# Altium schematic sheet Relay.SchDoc
size A4
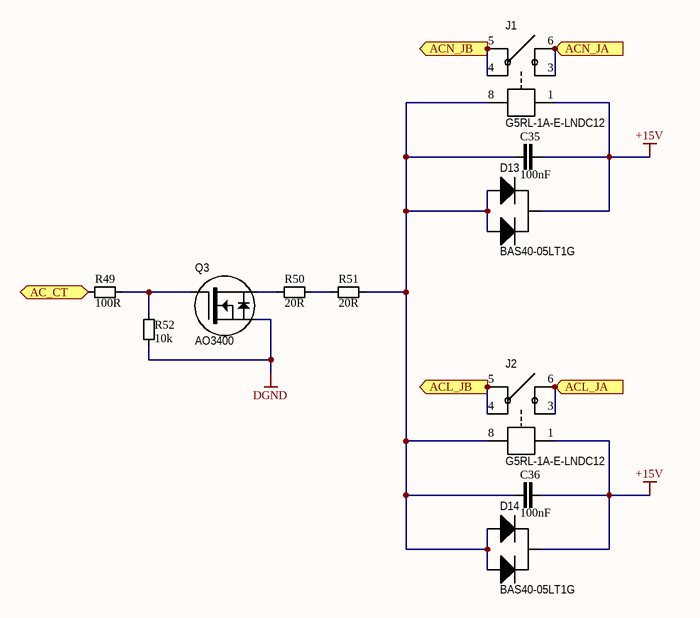
[diagram p0: Relay.SchDoc]

## Parts
C35  value 100nF  [0603-C]  (hidden comment: Cap)
C36  value 100nF  [0603-C]  (hidden comment: Cap)
D13  BAS40-05LT1G  [SOT-23_N]
D14  BAS40-05LT1G  [SOT-23_N]
J1  G5RL-1A-E-LNDC12  [G5RL-1A-E]
J2  G5RL-1A-E-LNDC12  [G5RL-1A-E]
Q3  AO3400  [SOT-23_N]
R49  value 100R  [0603-R]  (hidden comment: Res)
R50  value 20R  [1206-R]  (hidden comment: Res)
R51  value 20R  [1206-R]  (hidden comment: Res)
R52  value 10k  [0603-R]  (hidden comment: Res)

## Ports
AC_CT (in), ACL_JA (in), ACL_JB (out), ACN_JA (in), ACN_JB (out)

## Nets
+15V: C35.2 C36.2 D13.3 D14.3 J1.1 J2.1
DGND: Q3.2(S) R52.2
AC_CT: R49.1 ; port AC_CT
ACL_JA: J2.3 J2.6 ; port ACL_JA
ACL_JB: J2.4 J2.5 ; port ACL_JB
ACN_JA: J1.3 J1.6 ; port ACN_JA
ACN_JB: J1.4 J1.5 ; port ACN_JB
NetC35_1: C35.1 C36.1 D13.1 D13.2 D14.1 D14.2 J1.8 J2.8 R51.2
NetQ3_1: Q3.1(G) R49.2 R52.1
NetQ3_3: Q3.3(D) R50.1
NetR50_2: R50.2 R51.1

## Library data of the parts
C35 C36 = C21C100NK1H0: MLCC 100nF 10% 50V X7R 0603; TemperatureRange: -55°C to 150°C; VenderID: MLCC-0603-50V-104K-X7R; Published: 1-Jun-2017; Publisher: GreenBox; MountType: SMT; PackageReference: 0603; Manufacturer: *
D13 D14 = D842BAS4005O: Dual Series Schottky Barrier Diode BAS40-05LT1G Vrrm 40V If 0.12A Ir 1uA; Manufacturer: ON SEMICONDUCTOR; TemperatureRange: -55 to 150°C; MountType: SMT; PackageReference: SOT-23; Published: 1-Jun-2017; Publisher: GreenBox; VenderID: BAS40-05LT1G
J1 J2 = JNDZG5RL1122: Power/Signal Relay G5RL-1A-E-LNDC12 16A 250VAC 12VDC; Manufacturer: OMRON; TemperatureRange: -40 to 70°C; MountType: DIP; PackageReference: G5RL-1A-E; Published: 1-Jun-2017; Publisher: GreenBox; VenderID: G5RL-1A-E-LNDC12
Q3 = QN42AO34000A: N-Channel MOSFET AO3400 30V 5.8A; Manufacturer: ALPHA&OMEGA; TemperatureRange: -55 to 150°C; MountType: SMT; PackageReference: SOT-23; Published: 1-Jun-2017; Publisher: GreenBox; VenderID: AO3400
R49 = R11C100RFBF0: SMD Resistor 100R 1% 1/10W 0603 100PPM; TemperatureRange: -55°C to 150°C; VenderID: RES-0603-100R-1%; Published: 1-Jun-2017; Publisher: GreenBox; MountType: SMT; PackageReference: 0603; Manufacturer: *
R50 R51 = R11E020RFDF0: SMD Resistor 20R 1% 1/4W 1206 100PPM; TemperatureRange: -55°C to 150°C; VenderID: RES-1206-20R-1%; Published: 1-Jun-2017; Publisher: GreenBox; MountType: SMT; PackageReference: 1206; Manufacturer: *
R52 = R11C010KFBF0: SMD Resistor 10k 1% 1/10W 0603 100PPM; TemperatureRange: -55°C to 150°C; VenderID: RES-0603-10k-1%; Published: 1-Jun-2017; Publisher: GreenBox; MountType: SMT; PackageReference: 0603; Manufacturer: *